# EAGLE design voltage_switch (EAGLE 7.7.0)
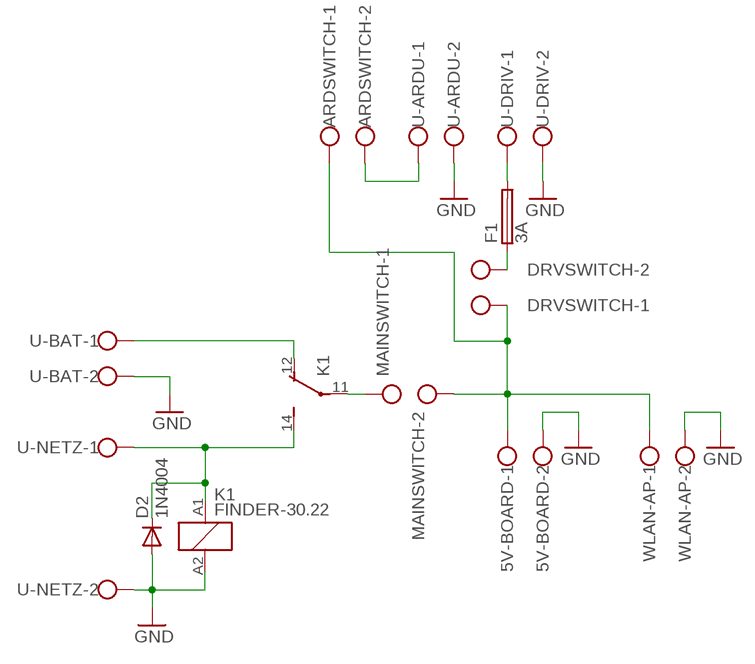
[diagram p0: schematic, sheet 1]

## Parts
5V-BOARD  W237-102  [W237-102]
ARDSWITCH  W237-102  [W237-102]
D2  1N4004  [DO41-10]
DRVSWITCH  W237-102  [W237-102]
F1  3A  GSH15  [GSH15]
K1  FINDER-30.22  [FINDER-30.22]
MAINSWITCH  W237-102  [W237-102]
U-ARDU  W237-102  [W237-102]
U-BAT  W237-102  [W237-102]
U-DRIV  W237-102  [W237-102]
U-NETZ  W237-102  [W237-102]
WLAN-AP  W237-102  [W237-102]

## Nets
GND: 5V-BOARD.2 D2.A K1.A2 U-ARDU.2 U-BAT.2 U-DRIV.2 U-NETZ.2 WLAN-AP.2
N$1: D2.C K1.14(-1:S) K1.A1 U-NETZ.1
N$2: K1.11(-1:P) MAINSWITCH.1
N$3: K1.12(-1:O) U-BAT.1
N$4: DRVSWITCH.2 F1.1
N$5: 5V-BOARD.1 ARDSWITCH.1 DRVSWITCH.1 MAINSWITCH.2 WLAN-AP.1
N$6: F1.2 U-DRIV.1
N$7: ARDSWITCH.2 U-ARDU.1
Unconnected: K1.21(-2:P) K1.22(-2:O) K1.24(-2:S)

## Library data of the parts
5V-BOARD ARDSWITCH DRVSWITCH MAINSWITCH U-ARDU U-BAT U-DRIV U-NETZ WLAN-AP = con-wago-500:W237-102: WAGO SCREW CLAMP; MPN: 237-102; OC_FARNELL: unknown; OC_NEWARK: 70K9898
D2 = diode:1N4004: DIODE general purpose rectifier, 1 A
F1 = fuse:GSH15: FUSE HOLDER grid 15mm, 19649 Wickmann; MPN: 64900001039; OC_FARNELL: 1271673; OC_NEWARK: 02P0318
K1 = relay:FINDER-30.22: SUBMINIATURE DIL-RELAIS FINDER 30.22.9.024.0000 Kontakt max. AC - 125V Distributor: Farnell Bestell Nr.: 1217371 Source: http://www.farnell.com/datasheets/87634.pdf; OC_FARNELL: unknown; OC_NEWARK: unknown

## Board
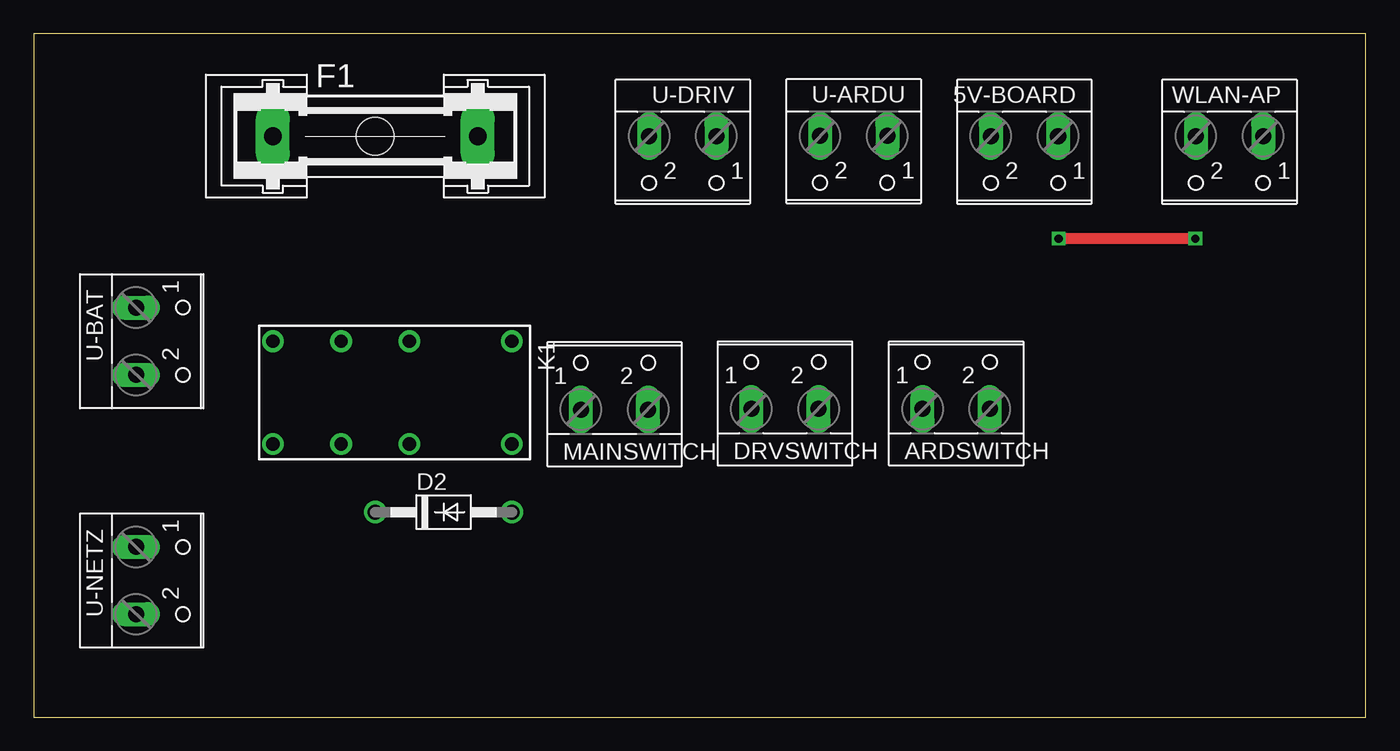
[diagram p1: board, top side]
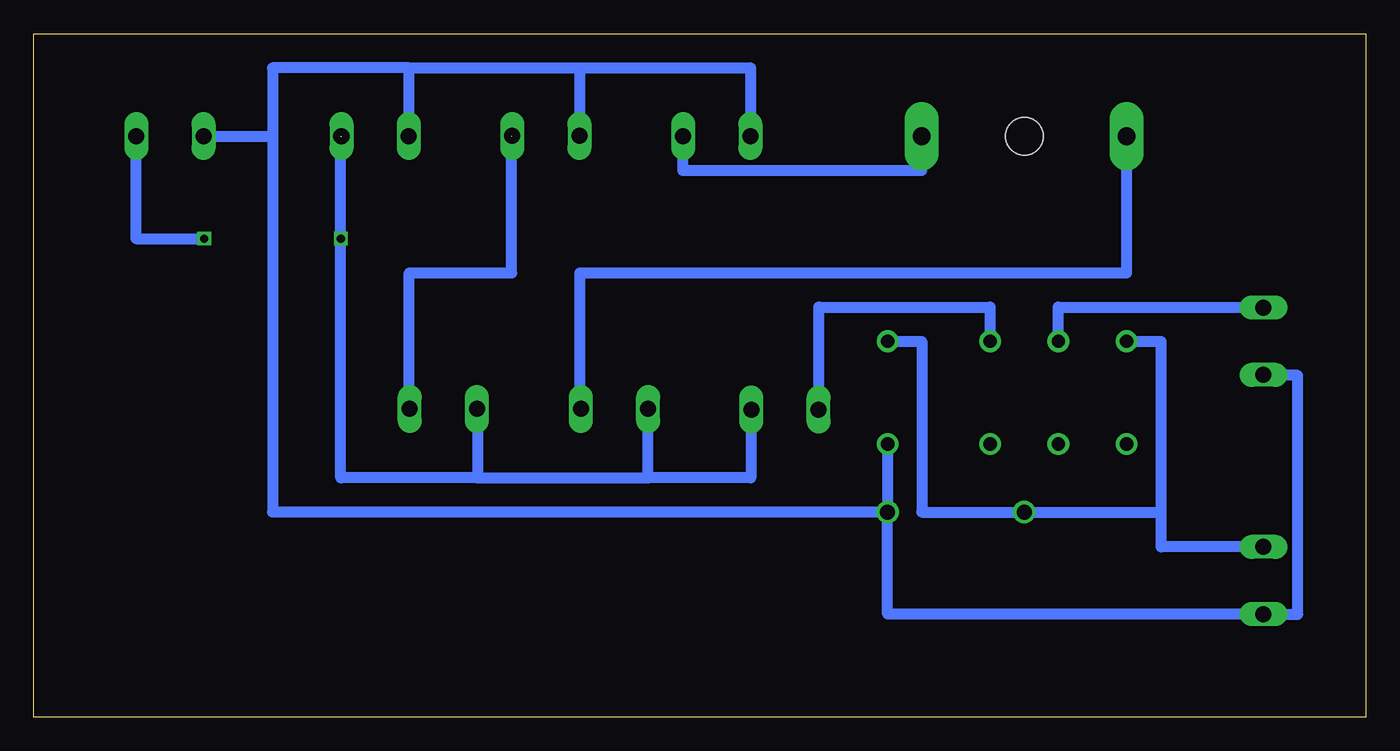
[diagram p2: board, bottom side, seen from below]

Size 99.04 x 50.8 mm. Coordinates in mm from the lower left corner, seen from the top.
Outline: 0,0 99.04,0 99.04,50.8 0,50.8 0,0
Copper layers (1*16): Top 0.035mm / dielectric 1.5mm / Bottom 0.035mm
Design rules "default": minimum track width 10mil, minimum drill 24mil, track to track 8mil, track to pad 8mil, pad to pad 8mil, via to via 8mil, smd to smd 8mil, copper to edge 40mil, drill to drill 8mil, minimum pad ring 10mil, minimum via ring 8mil, stop-mask expansion 4mil, vias tented up to drill 0mil, thermal gap 10mil

### Footprints (pad centres in the part's own frame; a part is rotated, then mirrored left to right if it is on the bottom)
W237-102 = drill 1.194 long: 1 -2.5,-1.27; 2 2.5,-1.27
DO41-10 = drill 1.118: A 5.08,0; C -5.08,0
GSH15 = drill 1.321 pad 2.54 long: 1 -7.62,0; 2 7.62,0 | hole 2.794: 0,0
FINDER-30.22 = drill 1 pad 1.6: 11 -1.27,-3.81; 12 3.81,-3.81; 14 8.89,-3.81; 21 -1.27,3.81; 22 3.81,3.81; 24 8.89,3.81; A1 -8.89,-3.81; A2 -8.89,3.81

### Placement (x,y rotation side)
5V-BOARD  73.66,41.91 180 top
ARDSWITCH  68.58,24.18 0 top
D2  30.48,15.24 0 top
DRVSWITCH  55.85,24.18 0 top
F1  25.4,43.18 0 top
K1  26.67,24.13 180 top
MAINSWITCH  43.18,24.13 0 top
U-ARDU  60.96,41.94 180 top
U-BAT  8.89,27.94 270 top
U-DRIV  48.26,41.91 180 top
U-NETZ  8.89,10.16 270 top
WLAN-AP  88.9,41.91 180 top

### Tracks (layer width: path | path; a pad name or v marks a point on that pad's centre or on a via)
GND
  Bottom 0.8: U-NETZ.2 35.56,7.66 D2.A | K1.A2 D2.A | D2.A 81.28,15.24 81.28,43.18 | 5V-BOARD.2 71.12,43.18 71.12,48.26 | 71.12,48.26 81.28,48.26 81.28,43.18 | 71.12,48.26 58.42,48.26 | 58.42,43.2 58.42,43.18 | U-ARDU.2 58.42,43.2 | 58.42,43.2 58.42,48.26 | 58.42,48.26 45.76,48.26 | 45.72,48.26 45.76,48.26 | 45.76,48.26 U-DRIV.2 | WLAN-AP.2 81.28,43.18
  Bottom 0.813: U-NETZ.2 5.08,7.66 | 5.08,7.66 5.08,7.62 | 5.08,7.66 5.08,25.4 7.62,25.4 U-BAT.2
N$1
  Bottom 0.8: K1.A1 33.02,27.94 33.02,15.24 D2.C 15.24,15.24
  Bottom 0.813: U-NETZ.1 15.24,12.66 15.24,15.24 15.24,27.94 K1.14
N$2
  Bottom 0.8: 40.64,30.48 40.68,30.48 MAINSWITCH.1
  Bottom 0.813: 40.64,30.48 27.94,30.48 K1.11
N$3
  Bottom 0.813: K1.12 22.86,30.48 7.62,30.48 U-BAT.1
N$4
  Bottom 0.8: DRVSWITCH.2 58.42,22.91 58.42,33.02 17.78,33.02 F1.1
N$5  (via drill 0.6)  (1 unrouted)
  Top 0.8: v86.36,35.56 v76.2,35.56
  Bottom 0.8: 45.68,22.91 MAINSWITCH.2 45.72,22.86 45.72,17.78 53.35,17.78 | 53.35,17.78 DRVSWITCH.1 | 66.04,17.78 53.35,17.78 | ARDSWITCH.1 66.04,22.91 66.04,17.78 | 66.04,17.78 76.2,17.78 v76.2,35.56 76.2,43.18 | WLAN-AP.1 91.44,43.18 91.44,35.56 v86.36,35.56
N$6
  Bottom 0.8: U-DRIV.1 50.8,43.18 50.8,40.64 33.02,40.64 F1.2
N$7  (1 unrouted)
  Bottom 0.8: ARDSWITCH.2 71.12,22.91 71.12,33.02 63.5,33.02 63.5,43.18

### Text on the board
tOrigins: GND | GND | GND | GND | GND